# EAGLE design reed-door-sensor (EAGLE 6.6.0)
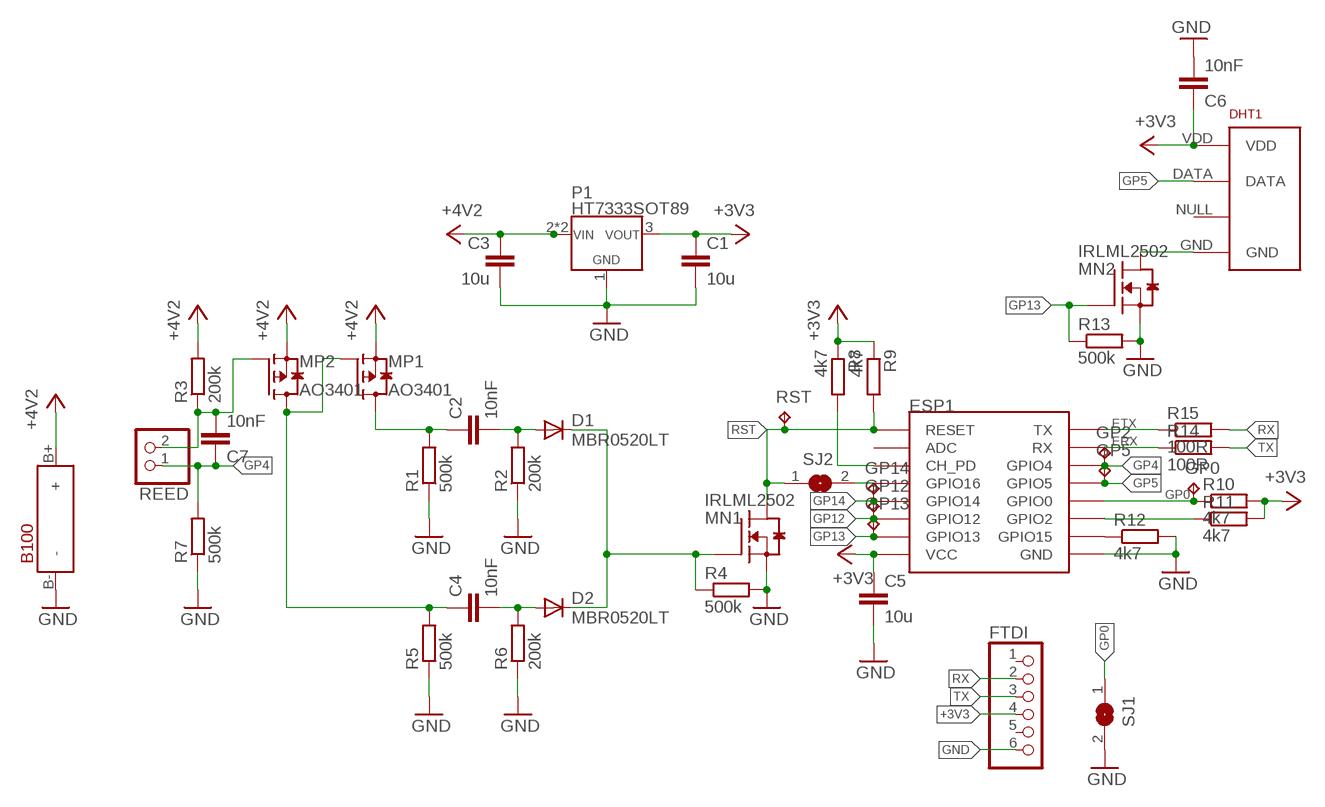
[diagram p0: schematic, sheet 1]

## Parts
B100  18650_1X  [18650_HOLDER_1X]
C1  10u  C-EUC1206  [C1206]
C2  10nF  C-EUC0805  [C0805]
C3  10u  C-EUC1206  [C1206]
C4  10nF  C-EUC0805  [C0805]
C5  10u  C-EUC1206  [C1206]
C6  10nF  C-EUC0805  [C0805]
C7  10nF  C-EUC0805  [C0805]
D1  MBR0520LT  [SOD123]
D2  MBR0520LT  [SOD123]
DHT1  RHT03_DHT-22_AM2302  [RHT03_DHT-22]
ESP1  ESP12SMD  [ESP12-SMD]
FTDI  PINHD-1X06_2.54-S  [1X06-S]
GP0  TPB2,54  [B2,54]
GP2  TPB1,27  [B1,27]
GP5  TPB1,27  [B1,27]
GP12  TPB1,27  [B1,27]
GP13  TPB1,27  [B1,27]
GP14  TPB1,27  [B1,27]
MN1  IRLML2502  N-CH_IRLML2502  [SOT23]
MN2  IRLML2502  N-CH_IRLML2502  [SOT23]
MP1  AO3401  P-CH_AO3401  [SOT23]
MP2  AO3401  P-CH_AO3401  [SOT23]
P1  HT7333SOT89  [SOT89]
R1  500k  R-EU_M0805  [M0805]
R2  200k  R-EU_M0805  [M0805]
R3  200k  R-EU_M0805  [M0805]
R4  500k  R-EU_M0805  [M0805]
R5  500k  R-EU_M0805  [M0805]
R6  200k  R-EU_M0805  [M0805]
R7  500k  R-EU_M0805  [M0805]
R8  4k7  R-EU_M0805  [M0805]
R9  4k7  R-EU_M0805  [M0805]
R10  4k7  R-EU_M0805  [M0805]
R11  4k7  R-EU_M0805  [M0805]
R12  4k7  R-EU_M0805  [M0805]
R13  500k  R-EU_M0805  [M0805]
R14  100R  R-EU_M0805  [M0805]
R15  100R  R-EU_M0805  [M0805]
REED  PINHD-1X02_2.54  [1X02]
RST  TPB2,54  [B2,54]
SJ1  SJ  [SJ]
SJ2  SJ  [SJ]

## Nets
+3V3 [power]: C1.1 C5.1 C6.1 DHT1.VDD ESP1.VCC FTDI.4 P1.3(VOUT) R8.1 R9.1 R10.2 R11.2
+5V [power]: B100.B+(+) C3.1 MP1.2(S) MP2.2(S) P1.2(VIN) P1.2@1(VIN) R3.2 ; supply symbol labelled +4V2
ERX: ESP1.RXD0(RX) R14.1
ETX: ESP1.TXD0(TX) R15.1
GND [power]: B100.B-(-) C1.2 C3.2 C5.2 C6.2 ESP1.GND FTDI.6 MN1.2(S) MN2.2(S) P1.1(GND) R1.1 R2.1 R4.2 R5.1 R6.1 R7.1 R12.2 R13.2 SJ1.2
GP0: ESP1.GPIO0 GP0.TP R10.1 SJ1.1
GP4: C7.1 ESP1.GPIO4 GP2.TP R7.2 REED.1
GP5: DHT1.DATA ESP1.GPIO5 GP5.TP
GP12: ESP1.GPIO12 GP12.TP
GP13: ESP1.GPIO13 GP13.TP MN2.1(G) R13.1
GP14: ESP1.GPIO14 GP14.TP
N$1: ESP1.GPIO16 SJ2.2
N$2: ESP1.CH_PD R8.2
N$3: C2.2 D1.A R2.2
N$4: ESP1.GPIO15 R12.1
N$5: ESP1.GPIO2 R11.1
N$6: C4.2 D2.A R6.2
N$7: C2.1 MP1.3(D) R1.2
N$8: C4.1 MP1.1(G) MP2.3(D) R5.2
N$10: D1.C D2.C MN1.1(G) R4.1
N$11 [power]: DHT1.GND MN2.3(D)
N$12: C7.2 MP2.1(G) R3.1 REED.2
RST: ESP1.RESET MN1.3(D) R9.2 RST.TP SJ2.1
RX: FTDI.2 R15.2
TX: FTDI.3 R14.2
Unconnected: DHT1.NULL ESP1.ADC FTDI.1 FTDI.5

## Library data of the parts
B100 = diyHue:18650_1X
C1-C7 = rcl:C-EU: CAPACITOR, European symbol
D1 D2 = diode:MBR0520LT: SCHOTTKY BARRIER RECTIFIER Source: http://onsemi.com .. MBR0520LT1-D.pdf
DHT1 = RHT03_DHT-22_AM2302:RHT03_DHT-22_AM2302: RHT03 / DHT-22 / AM2302 Packages and symbol for the RHT03 / DHT-22 relative humidity and temperature sensor. Note: The AM2302 is a wired version of the DHT-22 which typically requires less clearance and is thus provided as a separate package.; PROD_ID: SEN-10167
ESP1 = esp8266modules:ESP12: ESP8266 Wifi module 12
FTDI = pinhead-2:PINHD-1X06: PIN HEADER
GP0 GP2 GP5 GP12-GP14 RST = testpad:TP: Test pad
MN1 MN2 = diyHue:N-CH_IRLML2502
MP1 MP2 = diyHue:P-CH_AO3401
P1 = diyHue:HT7333
R1-R15 = rcl:R-EU_: RESISTOR, European symbol
REED = pinhead-2:PINHD-1X02: PIN HEADER
SJ1 SJ2 = jumper:SJ: SMD solder JUMPER

## Net classes
0 default: width 0.406 mm, drill 0.4 mm
1 power: width 0.61 mm, drill 0.5 mm

## Board
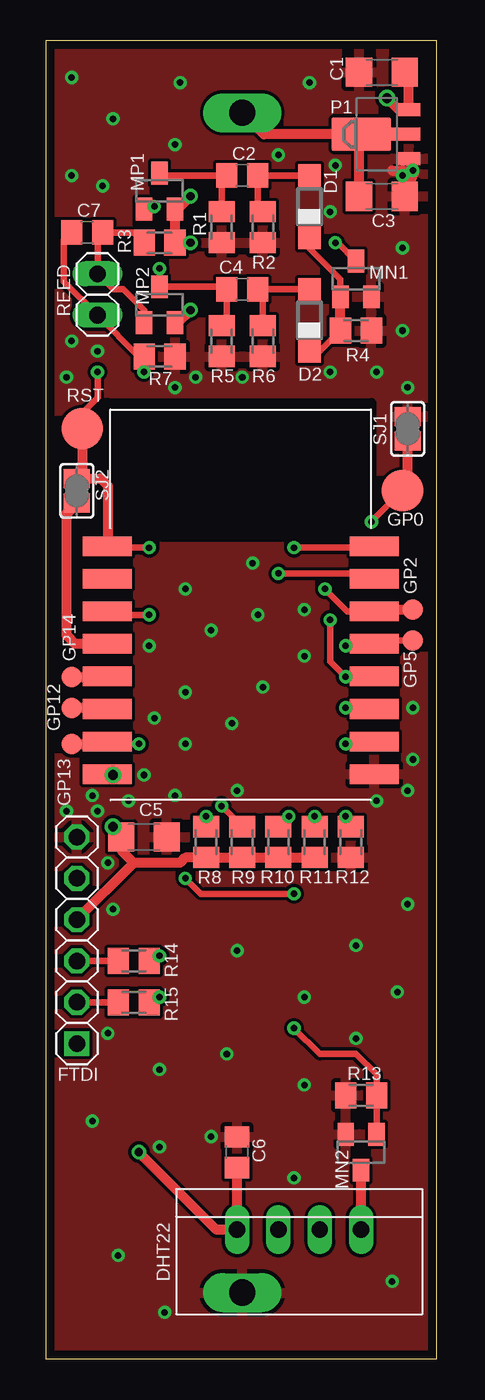
[diagram p1: board, top side]
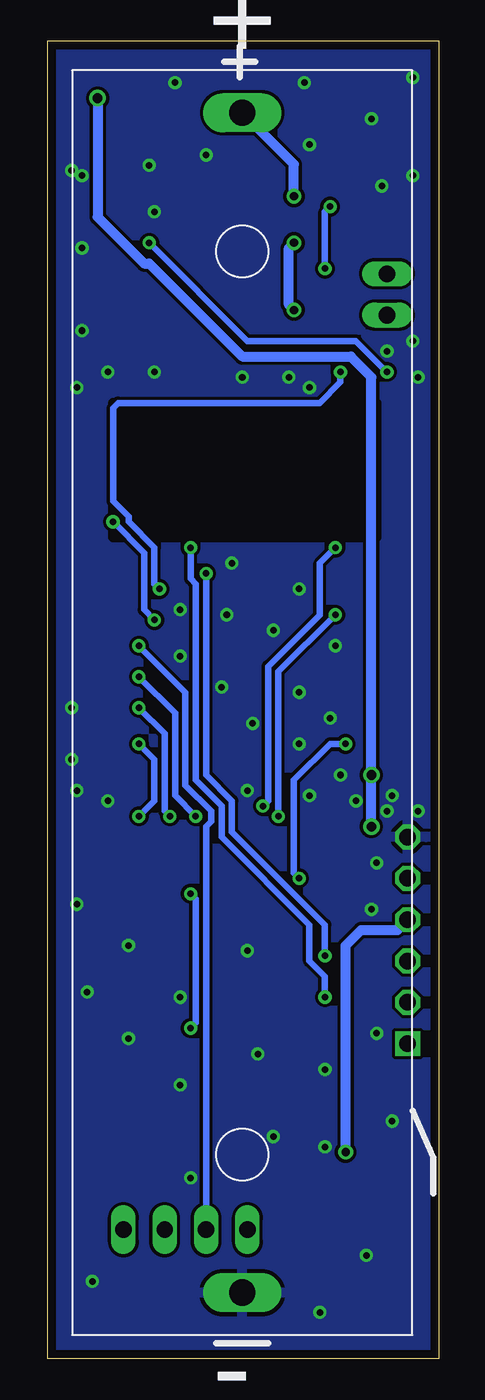
[diagram p2: board, bottom side, seen from below]

Size 24 x 81 mm. Coordinates in mm from the lower left corner, seen from the top.
Outline: 0,0 24,0 24,81 0,81 0,0
Copper layers (1*16): Top 0.035mm / dielectric 1.5mm / Bottom 0.035mm
Design rules "default *": minimum track width 10mil, minimum drill 0.3mm, track to track 8mil, track to pad 8mil, pad to pad 8mil, via to via 8mil, smd to smd 0mil, copper to edge 20mil, drill to drill 8mil, minimum pad ring 10mil, minimum via ring 8mil, stop-mask expansion 4mil, vias tented up to drill 50mil, thermal gap 10mil

### Footprints (pad centres in the part's own frame; a part is rotated, then mirrored left to right if it is on the bottom)
18650_HOLDER_1X = drill 1.6 long: B+ 37.52,0; B- -34.98,0
C1206 = smd 1.6 x 1.8: 1 -1.4,0; 2 1.4,0
C0805 = smd 1.3 x 1.5: 1 -0.95,0; 2 0.95,0
SOD123 = smd 1.4 x 1.4: A 1.9,0; C -1.9,0
RHT03_DHT-22 = drill 1 long: DATA -1.27,0; GND 3.81,0; NULL 1.27,0; VDD -3.81,0
ESP12-SMD = smd 3 x 1.2: ADC -8.3,3.8; CH_PD -8.3,1.8; GND 8.1,-8.2; GPIO0 8.1,-2.2; GPIO2 8.1,-4.2; GPIO4 8.1,1.8; GPIO5 8.1,-0.2; GPIO12 -8.3,-4.2; GPIO13 -8.3,-6.2; GPIO14 -8.3,-2.2; GPIO15 8.1,-6.2; GPIO16 -8.3,-0.2; RESET -8.3,5.8; RXD0 8.1,3.8; TXD0 8.1,5.8; VCC -8.3,-8.2
1X06-S = drill 1.016 square: 1 -6.35,0 | drill 1.016 octagon: 2 -3.81,0; 3 -1.27,0; 4 1.27,0; 5 3.81,0; 6 6.35,0
B2,54 = smd 2.54 x 2.54: TP 0,0
B1,27 = smd 1.27 x 1.27: TP 0,0
SOT23 = smd 1 x 1.4: 1 -0.95,-1.1; 2 0.95,-1.1; 3 0,1.1
SOT89 = smd 0.8 x 1.4: 1 -1.499,-1.981; 3 1.499,-1.981 | smd 0.8 x 1.9: 2 0,-1.727 | smd 2.032 x 3.65: 2@1 0,0.94
M0805 = smd 1.3 x 1.6: 1 -0.95,0; 2 0.95,0
1X02 = drill 1.016 long: 1 -1.27,0; 2 1.27,0
SJ = smd 1.168 x 1.6: 1 -0.762,0; 2 0.762,0

### Placement (x,y rotation side)
B100  12.06,39.05 90 bottom
C1  20.64,79.06 180 top
C2  12.06,72.71 0 top
C3  20.64,71.44 0 top
C4  12.06,65.72 0 top
C5  6.03,32.07 0 top
C6  11.75,12.7 90 top
C7  2.54,69.22 0 top
D1  16.19,70.8 90 top
D2  16.19,63.82 90 top
DHT1  15.56,7.94 0 top
ESP1  12.06,44.13 0 top
FTDI  1.91,25.72 90 top
GP0  21.91,53.34 0 top
GP2  22.54,46.04 0 top
GP5  22.54,44.13 0 top
GP12  1.59,40.01 0 top
GP13  1.59,37.78 0 top
GP14  1.59,41.91 0 top
MN1  19.05,66.36 0 top
MN2  19.37,12.7 180 top
MP1  6.99,71.75 0 top
MP2  6.99,64.77 0 top
P1  20.32,75.25 90 top
R1  10.79,69.53 90 top
R2  13.34,69.53 90 top
R3  6.99,68.58 0 top
R4  19.05,63.18 0 top
R5  10.79,62.55 90 top
R6  13.34,62.55 90 top
R7  6.99,61.59 180 top
R8  9.84,31.75 90 top
R9  12.06,31.75 90 top
R10  14.29,31.75 270 top
R11  16.51,31.75 270 top
R12  18.73,31.75 270 top
R13  19.37,16.19 180 top
R14  5.4,24.45 180 top
R15  5.4,21.91 180 top
REED  3.17,65.41 90 top
RST  2.22,57.15 0 top
SJ1  22.23,57.15 90 top
SJ2  1.91,53.34 270 top

### Tracks (layer width: path | path; a pad name or v marks a point on that pad's centre or on a via)
+3V3  (via drill 0.5, 0.6)
  Top 0.61: C1.1 22.3,78.79 P1.3 21.68,76.75 v20.95,77.47 | v4.13,35.88 3.87,35.93 ESP1.VCC 3.81,35.89 | R8.1 | R8.1 R9.1 R10.2 R11.2 | FTDI.4 5.4,30.48 | v4.13,32.7 C5.1 4.63,31.25 5.4,30.48 | v5.71,12.7 10.48,7.94 DHT1.VDD C6.1 | R8.1 8.57,30.8 8.26,30.48 5.4,30.48
  Bottom 0.61: v20.95,77.47 20.95,70.17 18.1,67.31 17.78,67.31 12.06,61.59 5.4,61.59 4.13,60.33 v4.13,35.88 v4.13,32.7 | v5.71,12.7 5.71,25.4 4.76,26.35 2.54,26.35 FTDI.4
+5V  (via drill 0.5)
  Top 0.61: P1.2@1 13.39,75.25 B100.B+ | C3.1 19.24,75.11 P1.2@1 | P1.2 P1.2@1 | MP2.2 8.11,63.67 v8.89,64.45 | v8.89,68.58 R3.2 MP1.2 8.11,70.66 v8.89,71.44
  Bottom 0.61: v8.89,64.45 9.21,64.77 9.21,68.26 v8.89,68.58 | v8.89,71.44 8.89,73.4 B100.B+
ERX  (via drill 0.4)
  Top 0.406: R14.1 6.67,24.45 v6.99,24.77 | v14.29,48.26 19.84,48.26 ESP1.RXD0
  Bottom 0.406: v6.99,24.77 6.99,26.67 12.7,32.38 12.7,34.29 14.29,35.88 v14.29,48.26
ETX  (via drill 0.4)
  Top 0.406: R15.1 6.67,21.91 v6.99,22.23 | v15.24,49.85 20.08,49.85 ESP1.TXD0
  Bottom 0.406: v6.99,22.23 6.99,23.5 7.94,24.45 7.94,26.67 13.34,32.07 13.34,33.97 14.92,35.56 14.92,47.62 15.24,47.94 v15.24,49.85
GND  (via drill 0.4)
  Top 0.61: P1.1 22.62,72.95 | 22.62,72.95 22.23,72.07 | 22.62,72.95 21.27,73.03 21.91,73.03 v21.91,72.71
  other vias: 22.54,36.83 22.54,40.01 22.23,59.69 20.32,60.64 17.46,60.64 21.91,63.18 21.91,68.26 17.46,70.48 17.78,73.34 14.29,73.98 7.94,74.61 16.19,78.42 8.26,78.42 1.59,78.74 4.13,76.2 1.59,72.71 3.49,72.07 6.35,43.81 8.57,40.96 6.67,39.37 7.94,34.61 20.32,34.29 22.23,34.92 19.05,25.4 22.23,27.94 11.75,25.08 3.81,30.48 3.81,20 7.3,2.86 4.45,6.35 6.99,13.02 2.86,14.61 11.11,18.73 15.88,22.23 19.05,19.68 15.88,16.83 15.24,11.11 10.16,13.65 6.99,17.78 21.27,4.76 21.59,22.54 8.57,37.78 11.75,34.92 11.43,39.05 13.34,41.27 10.16,44.77 8.57,47.31 12.7,48.9 13.02,45.72 15.88,43.18 15.88,46.04 4.13,27.62 22.54,73.03 12.06,60.33 9.21,60.33 7.94,59.69 2.86,34.61 1.27,33.66 5.08,34.29 6.03,35.88 3.17,61.91 1.59,62.55 1.27,60.33 3.17,33.66
  pour Bottom: -1.59,83.5 26.67,83.5 26.04,-1.59 -2.22,-1.59
  pour Top: -2.86,83.5 25.4,83.5 24.77,-1.59 -3.49,-1.59
GP0  (via drill 0.4)
  Top 0.406: R10.1 v14.92,33.34 | ESP1.GPIO0 20.14,41.91 v18.41,41.91 17.46,42.86 v17.46,45.4 | GP0.TP v20,51.44
  Top 0.61: SJ1.1 22.23,53.34 GP0.TP
  Bottom 0.406: v14.92,33.34 16.19,34.61 16.19,39.69 v18.41,41.91 | v20,51.44 18.1,49.53 18.1,46.04 v17.46,45.4
GP4  (via drill 0.4)
  Top 0.406: C7.1 1.11,68.74 1.11,66.2 REED.1 5.71,61.59 R7.2 | ESP1.GPIO4 18.52,45.93 v17.14,47.31 | 5.71,61.27 R7.2 | v6.03,60.64 R7.2
  Top 0.61: GP2.TP 20.32,46.04 ESP1.GPIO4 | 1.27,68.89 C7.1
  Bottom 0.406: v17.14,47.31 17.46,47.62 17.46,49.85 19.05,51.44 19.05,51.75 20,52.7 20,58.42 19.68,58.74 7.3,58.74 6.03,60.01 v6.03,60.64
GP5  (via drill 0.4)
  Top 0.406: GP5.TP 20.36,44.13 ESP1.GPIO5 20.05,43.81 v18.41,43.81
  Bottom 0.406: v18.41,43.81 15.56,40.96 15.56,35.24 13.97,33.66 13.97,33.02 14.29,32.7 DHT1.DATA
GP12
  Top 0.61: GP12.TP 3.49,40.01 ESP1.GPIO12
GP13  (via drill 0.4)
  Top 0.406: MN2.1 R13.1 20.32,17.46 19.05,18.73 16.83,18.73 v15.24,20.32 | v15.24,28.57 9.53,28.57 v8.57,29.53 | v5.71,37.78 3.92,37.78 ESP1.GPIO13
  Top 0.61: GP13.TP 3.49,37.78 ESP1.GPIO13
  Bottom 0.406: v15.24,20.32 14.92,20.64 14.92,28.26 v15.24,28.57 | v8.57,29.53 8.89,29.84 8.89,35.56 6.67,37.78 v5.71,37.78
GP14
  Top 0.61: GP14.TP 3.74,41.91 ESP1.GPIO14
N$1
  Top 0.61: ESP1.GPIO16 1.79,43.93 1.27,44.45 1.27,51.94 SJ2.2
N$2  (via drill 0.4)
  Top 0.406: R8.2 v9.84,33.34 | v6.35,45.72 3.98,45.72 ESP1.CH_PD
  Bottom 0.406: v9.84,33.34 9.84,42.23 v6.35,45.72
N$3
  Top 0.406: R2.2 13.02,70.8 C2.2 D1.A
N$4  (via drill 0.4)
  Top 0.406: R12.1 18.73,33.02 v18.41,33.34 | v18.41,37.78 20.02,37.78 ESP1.GPIO15
  Bottom 0.406: v18.41,33.34 17.46,34.29 17.46,36.83 v18.41,37.78
N$5  (via drill 0.4)
  Top 0.406: R11.1 v16.51,33.34 | v18.41,40.01 20.09,40.01 ESP1.GPIO2
  Bottom 0.406: v16.51,33.34 16.83,33.66 16.83,38.42 v18.41,40.01
N$6
  Top 0.406: R6.2 13.34,65.4 C4.2 D2.A
N$7
  Top 0.406: R1.2 10.79,72.39 C2.1 7.13,72.71 MP1.3
N$8  (via drill 0.4)
  Top 0.406: R5.2 11.12,63.82 C4.1 10.97,65.87 MP2.3 v6.99,66.99 | v6.67,70.8 6.21,70.48 MP1.1
  Bottom 0.406: v6.99,66.99 6.99,70.48 v6.67,70.8
N$9
  cutout Bottom: 3.81,58.74 20,58.74 20,50.48 3.81,50.48
  cutout Top: 3.81,58.74 20,58.74 20,50.48 3.81,50.48
N$10
  Top 0.406: MN1.1 18.1,66.36 16.19,68.26 D1.C | D2.C 16.84,61.92 R4.1
  Top 0.61: R4.1 MN1.1
N$11
  Top 0.61: DHT1.GND MN2.3
N$12
  Top 0.406: MP2.1 6.04,64.45 4.76,65.72 4.13,65.72 REED.2 3.17,68.9 C7.2 5.4,69.22 R3.1
RST  (via drill 0.4)
  Top 0.406: R9.2 v10.79,33.97 | v6.35,49.85 3.85,49.85 ESP1.RESET | RST.TP 2.22,58.1 3.17,59.05 v3.17,60.64 | v17.78,68.58 17.93,68.58 MN1.3
  Top 0.61: ESP1.RESET 3.81,49.98 3.81,53.66 3.37,54.1 SJ2.1 2.22,54.42 RST.TP
  Bottom 0.406: v10.79,33.97 10.48,34.29 10.48,42.55 7.3,45.72 7.3,48.9 v6.35,49.85 | v3.17,60.64 5.08,62.55 11.75,62.55 v17.78,68.58
RX
  Top 0.406: R15.2 FTDI.2
TX
  Top 0.406: R14.2 FTDI.3

### Text on the board
tNames: DHT22
_tPlace: U1
_tNames: C3 | C1 | P1 | C4 | U$2 | D1 | R4 | R6 | R7 | U$3 | C2 | U$1 | R3 | REED | R1 | R2 | D2 | R5 | RST | U2 | SJ1 | GP0 | SJ2 | GP4 | GP5 | GP14 | GP12 | GP13 | R12 | R11 | R10 | C5 | R9 | R8 | U$4 | C6 | R13 | R15 | R14 | FTDI